# Altium schematic sheet MCU.schdoc
size 262 x 186 mm
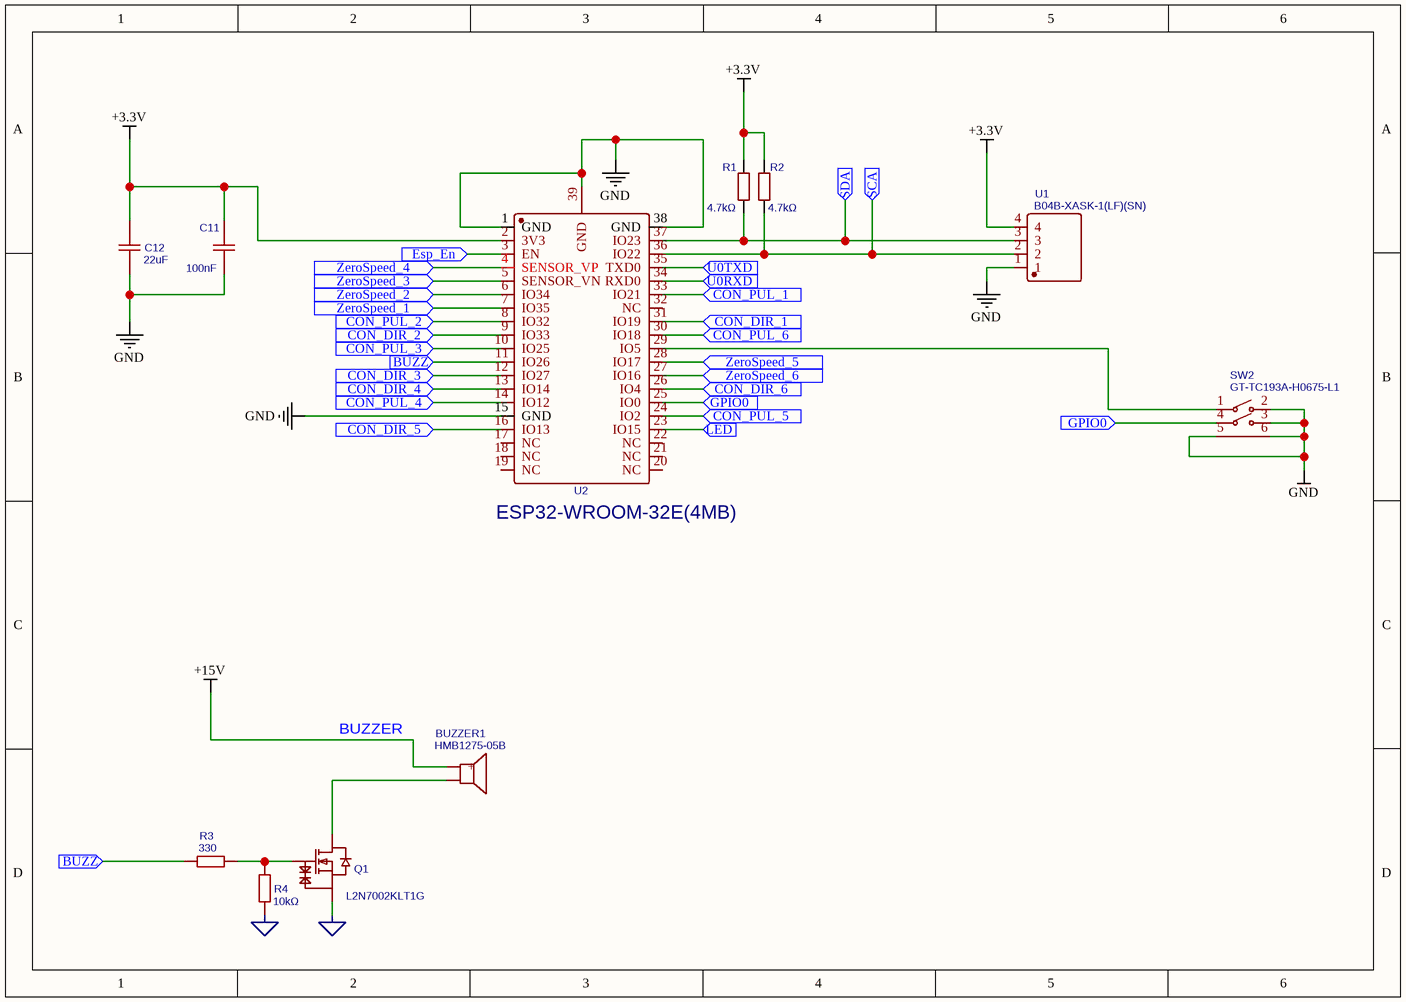
[diagram p0: MCU.schdoc]

## Parts
BUZZER1  HMB1275-05B  [BUZ-TH_BD12.0-P7.60-D0.6-FD]
C11  100nF  [C0805]
C12  22uF  [C0805]
Q1  L2N7002KLT1G  [SOT-23-3]
R1  4.7kΩ  [R0805]
R2  4.7kΩ  [R0805]
R3  330  [R0805]
R4  10kΩ  [R0805]
SW2  GT-TC193A-H0675-L1  [SW-TH_GT-TC193A-H0675-L1]
U1  B04B-XASK-1(LF)(SN)  [CONN-TH_B04B-XASK-1-LF-SN]
U2  ESP32-WROOM-32E(4MB)  [WIFI-SMD_ESP32-WROOM-32E]

## Ports
BUZZ (in), CON_DIR_1 (in), CON_DIR_2 (in), CON_DIR_3 (in), CON_DIR_4 (in), CON_DIR_5 (in), CON_DIR_6 (in), CON_PUL_1 (in), CON_PUL_2 (in), CON_PUL_3 (in), CON_PUL_4 (in), CON_PUL_5 (in), CON_PUL_6 (in), Esp_En (in), GPIO0 (in), LED (in), SCA (in), SDA (in), U0RXD (in), U0TXD (in), ZeroSpeed_1 (in), ZeroSpeed_2 (in), ZeroSpeed_3 (in), ZeroSpeed_4 (in), ZeroSpeed_5 (in), ZeroSpeed_6 (in)

## Nets
+3.3V: C11.2 C12.2 R1.2 R2.2 U1.4 U2.2(3V3)
+15V: BUZZER1.1(+)
GND: C11.1 C12.1 Q1.2(S) R4.1 SW2.2(b) SW2.3(d) SW2.5 SW2.6 U1.1 U2.1(GND) U2.15(GND) U2.38(GND) U2.39(GND)
BUZZ: R3.2 U2.11(IO26) ; port BUZZ
CON_DIR_1: U2.31(IO19) ; port CON_DIR_1
CON_DIR_2: U2.9(IO33) ; port CON_DIR_2
CON_DIR_3: U2.12(IO27) ; port CON_DIR_3
CON_DIR_4: U2.13(IO14) ; port CON_DIR_4
CON_DIR_5: U2.16(IO13) ; port CON_DIR_5
CON_DIR_6: U2.26(IO4) ; port CON_DIR_6
CON_PUL_1: U2.33(IO21) ; port CON_PUL_1
CON_PUL_2: U2.8(IO32) ; port CON_PUL_2
CON_PUL_3: U2.10(IO25) ; port CON_PUL_3
CON_PUL_4: U2.14(IO12) ; port CON_PUL_4
CON_PUL_5: U2.24(IO2) ; port CON_PUL_5
CON_PUL_6: U2.30(IO18) ; port CON_PUL_6
Esp_En: U2.3(EN) ; port Esp_En
GPIO0: SW2.4(c) U2.25(IO0) ; port GPIO0
LED: U2.23(IO15) ; port LED
SCA: R2.1 U1.2 U2.36(IO22) ; port SCA
SDA: R1.1 U1.3 U2.37(IO23) ; port SDA
U0RXD: U2.34(RXD0) ; port U0RXD
U0TXD: U2.35(TXD0) ; port U0TXD
ZeroSpeed_1: U2.7(IO35) ; port ZeroSpeed_1
ZeroSpeed_2: U2.6(IO34) ; port ZeroSpeed_2
ZeroSpeed_3: U2.5(SENSOR_VN) ; port ZeroSpeed_3
ZeroSpeed_4: U2.4(SENSOR_VP) ; port ZeroSpeed_4
ZeroSpeed_5: U2.28(IO17) ; port ZeroSpeed_5
ZeroSpeed_6: U2.27(IO16) ; port ZeroSpeed_6
NetBUZZER1_2: BUZZER1.2 Q1.3(D)
NetQ1_1: Q1.1(G) R3.1 R4.2
NetSW2_1: SW2.1(a) U2.29(IO5)

Not connected (* = marked no-connect by the designer): U2 17(NC) 18(NC) 19(NC) 20(NC) 21(NC) 22(NC) 32(NC)

## Notes on the sheet
- BUZZER

## Library data of the parts
BUZZER1 = HMB1275-05B: Manufacturer: HNDZ; Frequency: 2300Hz; Supplier: LCSC; Manufacturer Part: HMB1275-05B; Supplier Part: C96491; JLCPCB Part Class: Extended Part; spicePre: B; spiceSymbolName: HMB1275-05B
C11 = 100nF: Manufacturer: YAGEO; Manufacturer Part: CC0805KRX7R8BB104; nameAlias: Capacitance; Contributor: LCSC; Supplier: LCSC; Supplier Part: C519981; JLCPCB Part Class: Extended Part; spicePre: C; spiceSymbolName: CC0805KRX7R8BB104
C12 = 22uF: Manufacturer: SAMSUNG; Manufacturer Part: CL21A226KQQNNNE; nameAlias: Capacitance; Supplier: LCSC; Supplier Part: C87997; JLCPCB Part Class: Extended Part; spicePre: C; spiceSymbolName: CL21A226KQQNNNE
Q1 = L2N7002KLT1G: Manufacturer: LRC; Manufacturer Part: L2N7002SLT1G; Supplier: LCSC; spicePre: Q; Supplier Part: C250818
R1 R2 = 4.7kΩ: Manufacturer: UniOhm; Manufacturer Part: 0805W8J0472T5E; nameAlias: Resistance; Resistance (Ohms): 4.7K; Supplier: LCSC; Supplier Part: C26022; JLCPCB Part Class: Extended Part; spicePre: R; spiceSymbolName: 0805W8J0472T5E
R3 = 330: Manufacturer: YAGEO; Manufacturer Part: AC0805FR-07330RL; nameAlias: Resistance (Ohms); Contributor: LCSC; Resistance: 330Ω; Supplier: LCSC; Supplier Part: C144564; JLCPCB Part Class: Extended Part; spicePre: R; spiceSymbolName: AC0805FR-07330RL
R4 = 10kΩ: Manufacturer: Ever Ohms Tech; Manufacturer Part: TR0805D10KP0550; Resistance (Ohms): 10K; nameAlias: Resistance; Contributor: LCSC; Supplier: LCSC; Supplier Part: C332266; JLCPCB Part Class: Extended Part; spicePre: R; spiceSymbolName: TR0805D10KP0550
SW2 = GT-TC193A-H0675-L1: Manufacturer: G-Switch(品赞); Contributor: LCSC; Supplier: LCSC; Supplier Part: C2835017; Manufacturer Part: GT-TC193A-H0675-L1; spicePre: S; spiceSymbolName: GT-TC193A-H0675-L1
U1 = B04B-XASK-1(LF)(SN): Manufacturer: JST Sales America; Contributor: LCSC; Supplier: LCSC; Supplier Part: C264994; Manufacturer Part: B04B-XASK-1(LF)(SN); JLCPCB Part Class: Extended Part; spicePre: U; spiceSymbolName: B04B-XASK-1(LF)(SN)
U2 = ESP32-WROOM-32E(4MB): Manufacturer: Espressif Systems; Contributor: LCSC; Supplier: LCSC; Supplier Part: C701341; Manufacturer Part: ESP32-WROOM-32E(4MB); JLCPCB Part Class: Extended Part; spicePre: U; spiceSymbolName: ESP32-WROOM-32E(4MB)